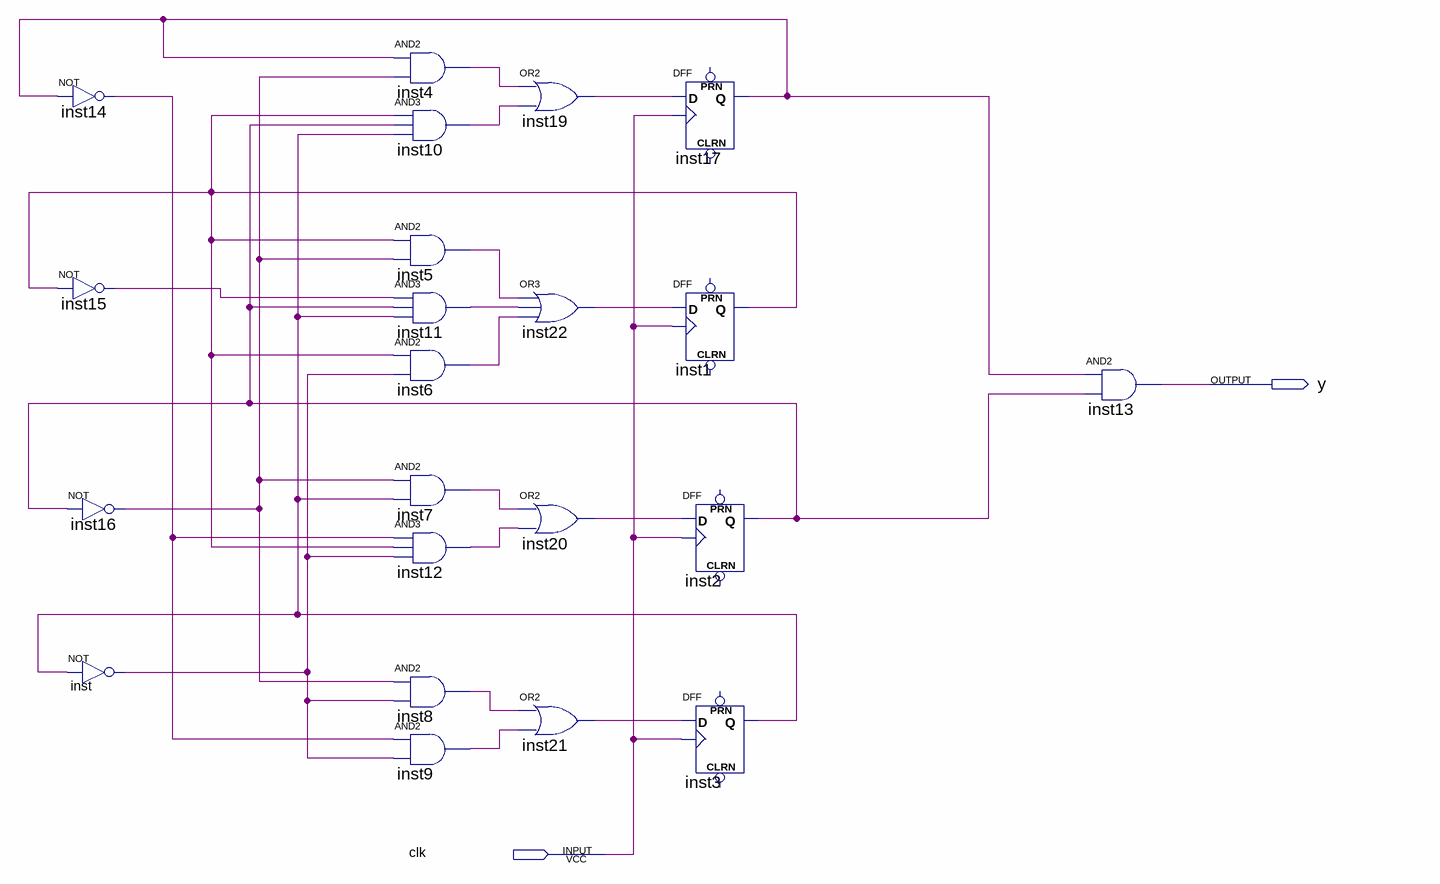
[diagram p0: schematic sheet]
// Quartus schematic 11Xdec.bdf as structural Verilog: 22 symbols, 2 pins
module \11Xdec  (
  input  clk,
  output y
);

  wire inst1_q, inst2_q, inst3_q, inst4_out, inst5_out, inst6_out, inst7_out, inst8_out, inst9_out,
       inst10_out, inst11_out, inst12_out, inst14_out, inst15_out, inst16_out, inst17_q, inst19_out,
       inst20_out, inst21_out, inst22_out, inst_out;

  not inst14 (inst14_out, inst17_q);
  not inst15 (inst15_out, inst1_q);
  not inst16 (inst16_out, inst2_q);
  not inst (inst_out, inst3_q);
  and inst4 (inst4_out, inst17_q, inst16_out);
  and inst10 (inst10_out, inst1_q, inst2_q, inst3_q);
  and inst5 (inst5_out, inst1_q, inst16_out);
  and inst11 (inst11_out, inst15_out, inst2_q, inst3_q);
  and inst6 (inst6_out, inst1_q, inst_out);
  and inst7 (inst7_out, inst16_out, inst3_q);
  and inst12 (inst12_out, inst14_out, inst1_q, inst_out);
  and inst8 (inst8_out, inst16_out, inst_out);
  and inst9 (inst9_out, inst14_out, inst_out);
  or inst19 (inst19_out, inst4_out, inst10_out);
  or inst22 (inst22_out, inst5_out, inst11_out, inst6_out);
  or inst20 (inst20_out, inst7_out, inst12_out);
  or inst21 (inst21_out, inst8_out, inst9_out);
  DFF inst17 (.CLK(clk), .D(inst19_out), .Q(inst17_q));  // open: CLRN, PRN
  DFF inst1 (.CLK(clk), .D(inst22_out), .Q(inst1_q));  // open: CLRN, PRN
  DFF inst2 (.CLK(clk), .D(inst20_out), .Q(inst2_q));  // open: CLRN, PRN
  DFF inst3 (.CLK(clk), .D(inst21_out), .Q(inst3_q));  // open: CLRN, PRN
  and inst13 (y, inst17_q, inst2_q);
endmodule
